# EAGLE design rz568m-power-data-v2 (EAGLE 7.7.0)
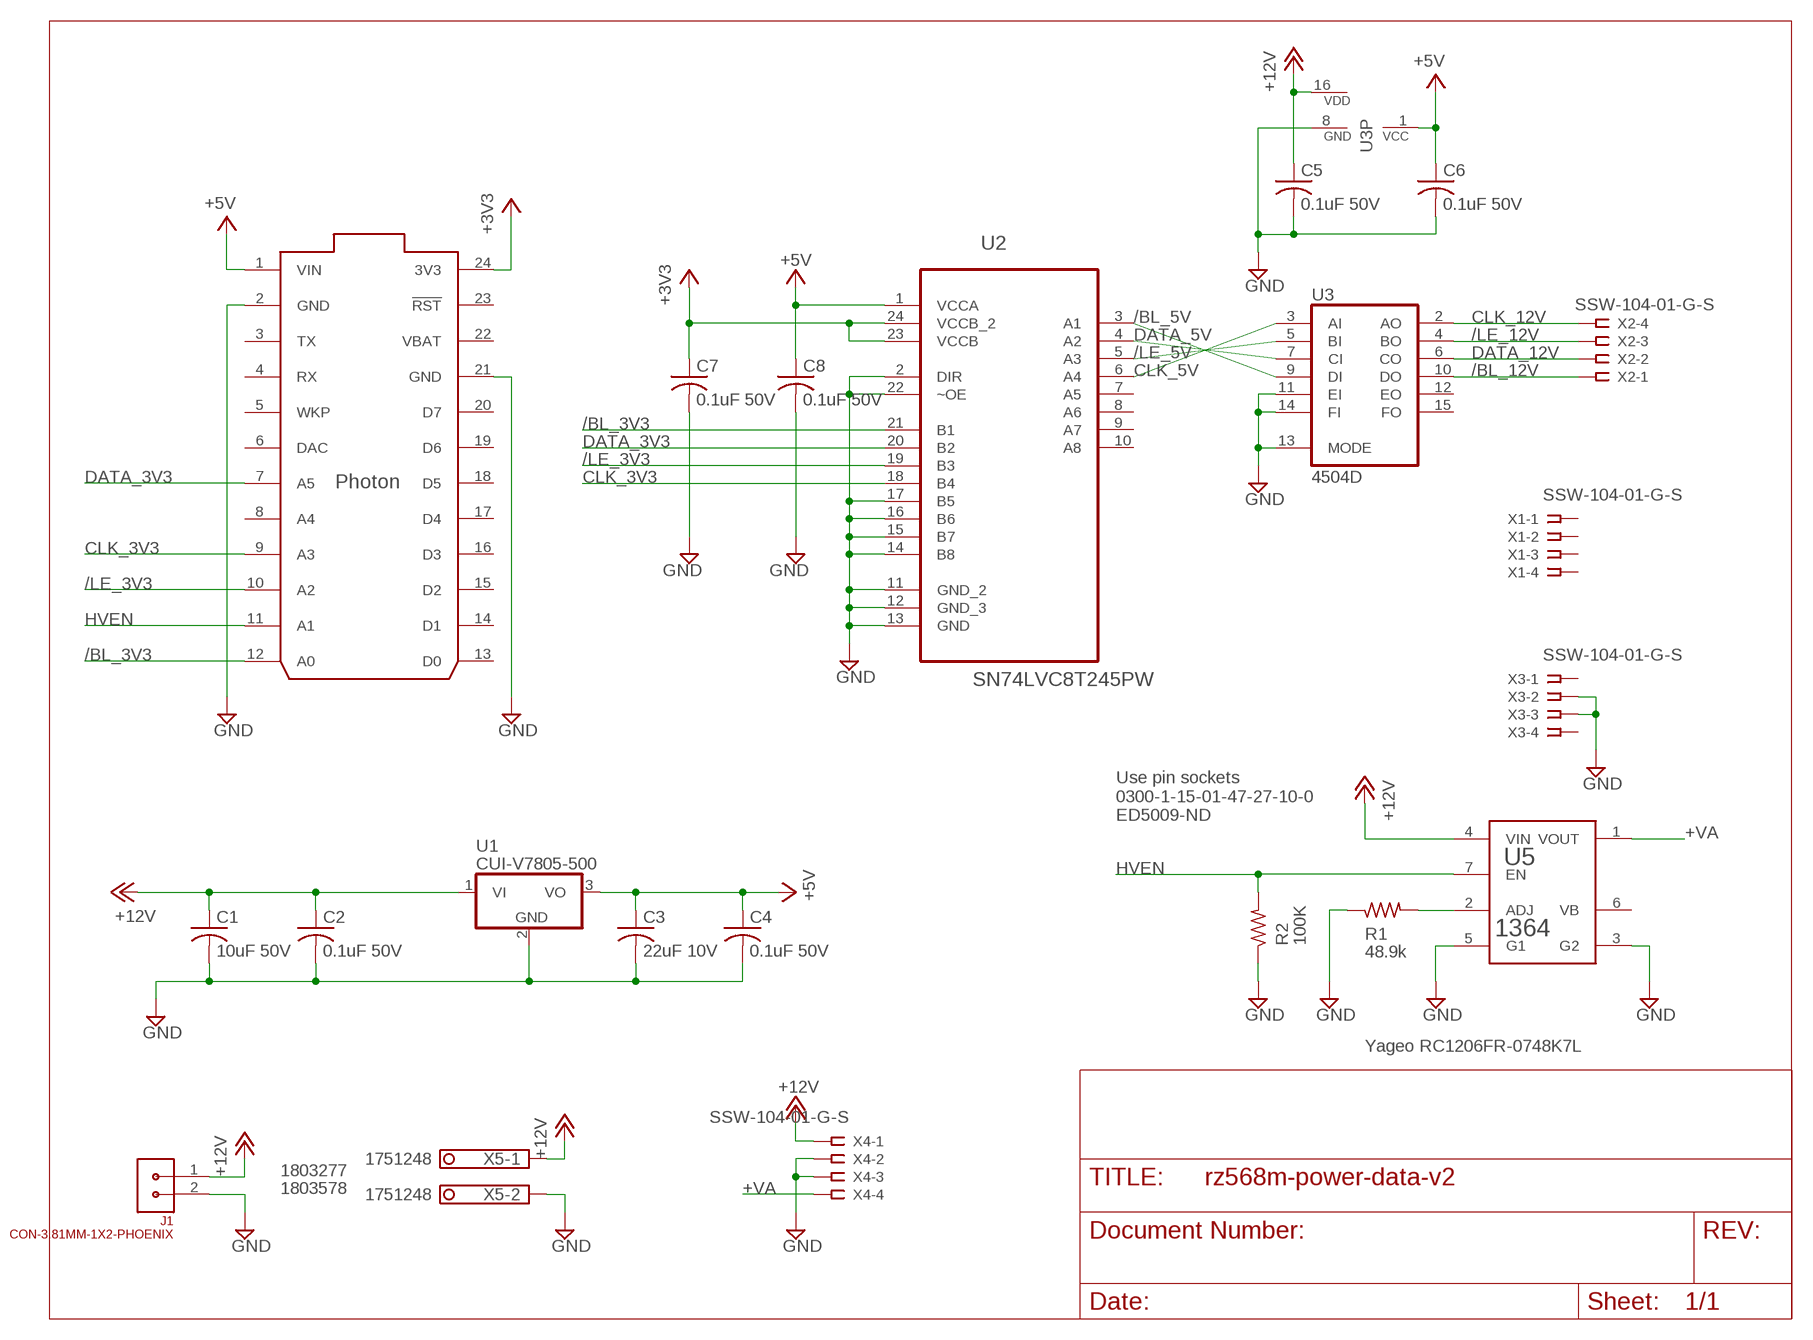
[diagram p0: schematic, sheet 1]

## Parts
C1  10uF 50V  C-USC1210K  [C1210K]
C2  0.1uF 50V  C-USC1206K  [C1206K]
C3  22uF 10V  C-USC1206K  [C1206K]
C4  0.1uF 50V  C-USC1206K  [C1206K]
C5  0.1uF 50V  C-USC0805K  [C0805K]
C6  0.1uF 50V  C-USC0805K  [C0805K]
C7  0.1uF 50V  C-USC0805K  [C0805K]
C8  0.1uF 50V  C-USC0805K  [C0805K]
J1  CON-3.81MM-1X2-PHOENIX  [CON-PHOENIX-3.81-1X2-RA]
R1  48.9k  R-US_R1206  [R1206]
R2  100K  R-US_R1206  [R1206]
U1  CUI-V7805-500  CUI-V7803-500  [CUI-78XX-500]
U2  SN74LVC8T245PW  SN74AVC8T245PW  [SOP65P640X120-24N]
U3  4504D  [SO16]
U4  PHOTON_WITH_HEADERS  [PHOTON]
U5  1364  [1364]
X1  SSW-104-01-G-S  SSW-104-02-S-S  [SSW-104-02-S-S]
X2  SSW-104-01-G-S  SSW-104-02-S-S  [SSW-104-02-S-S]
X3  SSW-104-01-G-S  SSW-104-02-S-S  [SSW-104-02-S-S]
X4  SSW-104-01-G-S  SSW-104-02-S-S  [SSW-104-02-S-S]
X5  1751248  [1751248]

## Nets
+3V3: C7.1 U2.23(VCCB) U2.24(VCCB_2) U4.24(3V3)
+5V: C3.1 C4.1 C6.1 C8.1 U1.3(VO) U2.1(VCCA) U3.1(VCC) U4.1(VIN)
+12V: C1.1 C2.1 C5.1 J1.1 U1.1(VI) U3.16(VDD) U5.4(VIN) X4.1 X5.1
+VA: U5.1(VOUT) X4.4
/BL_3V3: U2.21(B1) U4.12(A0)
/BL_5V: U2.3(A1) U3.9(DI)
/BL_12V: U3.10(DO) X2.1
/LE_3V3: U2.19(B3) U4.10(A2)
/LE_5V: U2.5(A3) U3.5(BI)
/LE_12V: U3.4(BO) X2.3
CLK_3V3: U2.18(B4) U4.9(A3)
CLK_5V: U2.6(A4) U3.3(AI)
CLK_12V: U3.2(AO) X2.4
DATA_3V3: U2.20(B2) U4.7(A5)
DATA_5V: U2.4(A2) U3.7(CI)
DATA_12V: U3.6(CO) X2.2
GND: C1.2 C2.2 C3.2 C4.2 C5.2 C6.2 C7.2 C8.2 J1.2 R1.1 R2.1 U1.2(GND) U2.2(DIR) U2.11(GND_2) U2.12(GND_3) U2.13(GND) U2.14(B8) U2.15(B7) U2.16(B6) U2.17(B5) U2.22(~OE) U3.8(GND) U3.11(EI) U3.13(MODE) U3.14(FI) U4.2(GND) U4.21(GND) U5.3(G2) U5.5(G1) X3.2 X3.3 X4.2 X4.3 X5.2
HVEN: R2.2 U4.11(A1) U5.7(EN)
N$3: R1.2 U5.2(ADJ)
Unconnected: U2.7(A5) U2.8(A6) U2.9(A7) U2.10(A8) U3.12(EO) U3.15(FO) U4.3(TX) U4.4(RX) U4.5(WKP) U4.6(DAC) U4.8(A4) U4.13(D0) U4.14(D1) U4.15(D2) U4.16(D3) U4.17(D4) U4.18(D5) U4.19(D6) U4.20(D7) U4.23(!RST) U5.6(VB) X1.1 X1.2 X1.3 X1.4 X3.1 X3.4

## Notes on the sheet
- Use pin sockets
  0300-1-15-01-47-27-10-0
  ED5009-ND
- Yageo RC1206FR-0748K7L
- 1803277
- 1803578

## Power pins joined to a net without a drawn wire
VBAT: U4.22(VBAT)

## Library data of the parts
C1 = rcl:C-US: CAPACITOR, American symbol; MFR: KEMET; MFR_PART_NO: C1210C106K5RACTU
C2 C4-C8 = rcl:C-US: CAPACITOR, American symbol; MFR: KEMET; MFR_PART_NO: C1206S104M5RACTU
C3 = rcl:C-US: CAPACITOR, American symbol; MFR: KEMET; MFR_PART_NO: C1206C226K8RAC7800
J1 = 0GlenConnectors:CON-3.81MM-1X2-PHOENIX
R1 R2 = rcl:R-US_: RESISTOR, American symbol
U1 = GlenPartsLibrary:CUI-V7803-500
U2 = Texas Instruments_By_element14_Batch_1:SN74AVC8T245PW: TRANSCEIVER; MPN: SN74AVC8T245PW; OC_FARNELL: 1053490; OC_NEWARK: 10J9626; PACKAGE: TSSOP-24; SUPPLIER: Texas Instruments
U3 = 45xx:4504: TTL or CMOS to CMOS hex LEVEL SHIFTER
U4 = Particle:PHOTON
U5 = TES:1364: TES1364 HVPS Horizontal module
X1-X4 = con-samtec:SSW-104-02-S-S: THROUGH-HOLE .025" SQ POST SOCKET Source: Samtec SSW.pdf; MPN: SSW-104-02-S-S; OC_FARNELL: unknown; OC_NEWARK: 11P9384
X5 = con-phoenix-350:1751248: MKDS 1/ 2-3,5 Printklemme Nennstrom: 10 A Bemessungsspannung: 160 V Raster: 3,5 mm Polzahl: 2 Montageart: Löten Anschlussart: Schraubanschluss Anschlussrichtung vom Leiter zur Platine: 0° Source: http://eshop.phoenixcontact.com .. 1751248.pdf; OC_FARNELL: unknown; OC_NEWARK: unknown

## Board
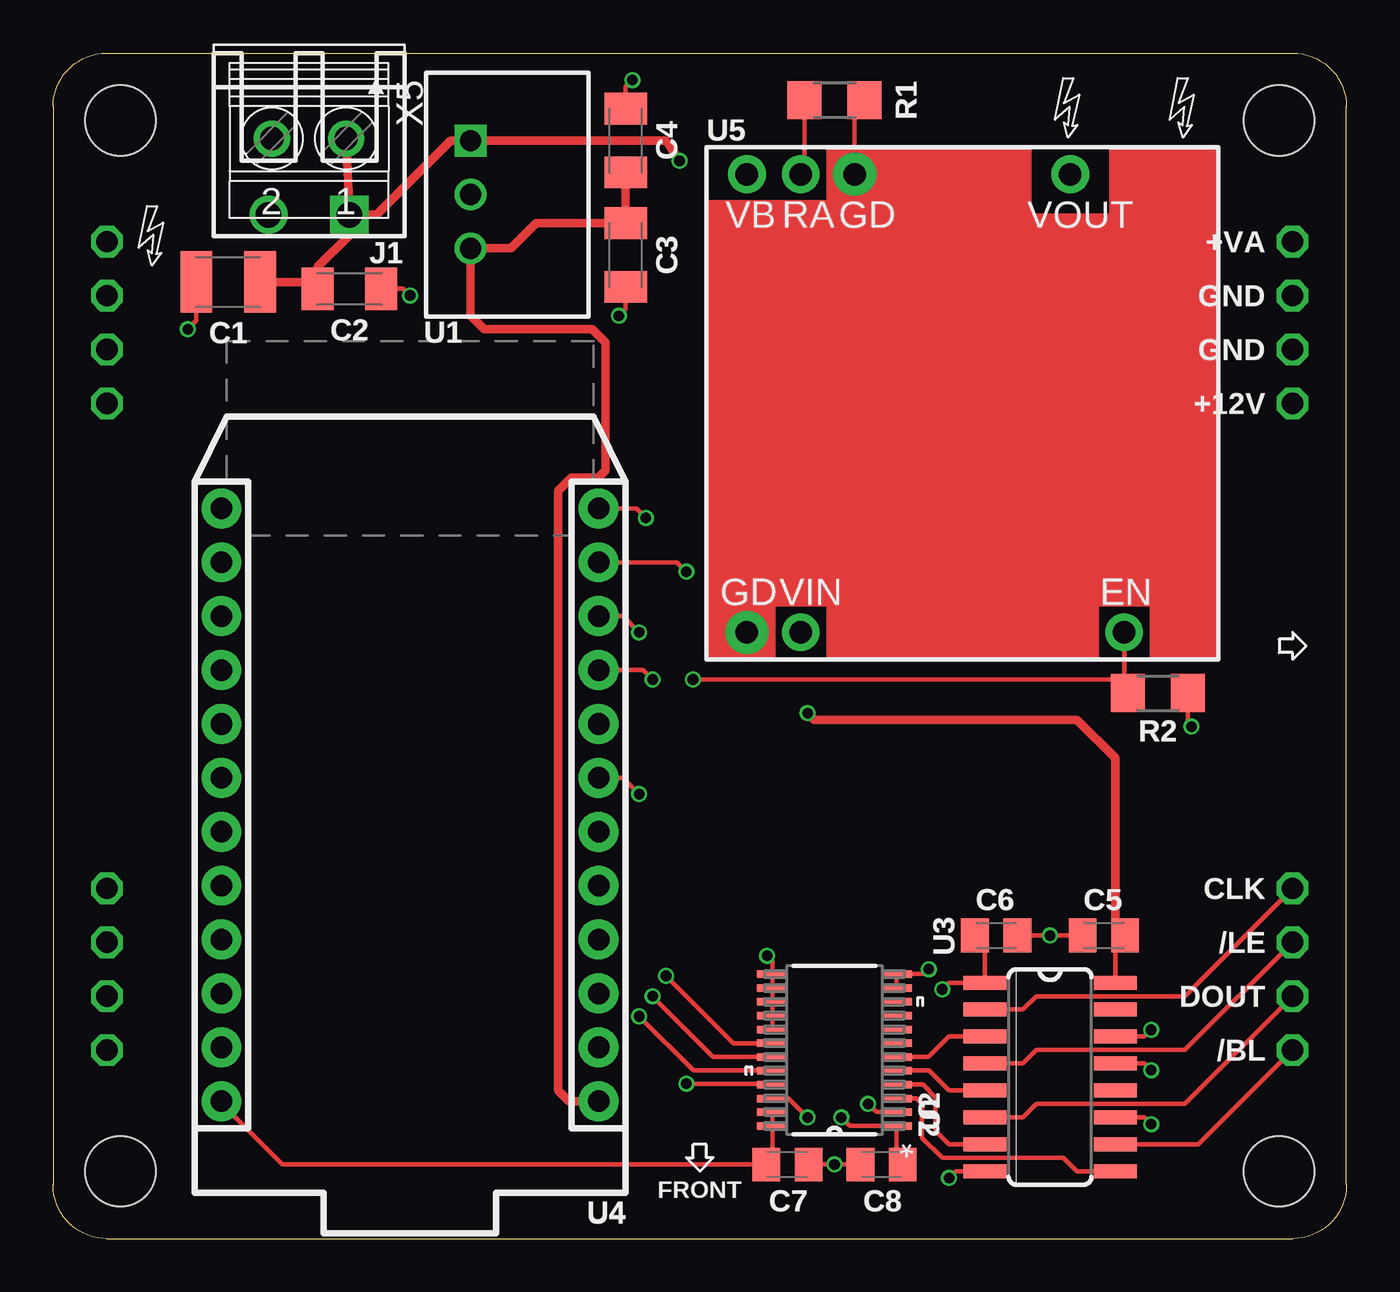
[diagram p1: board, top side]
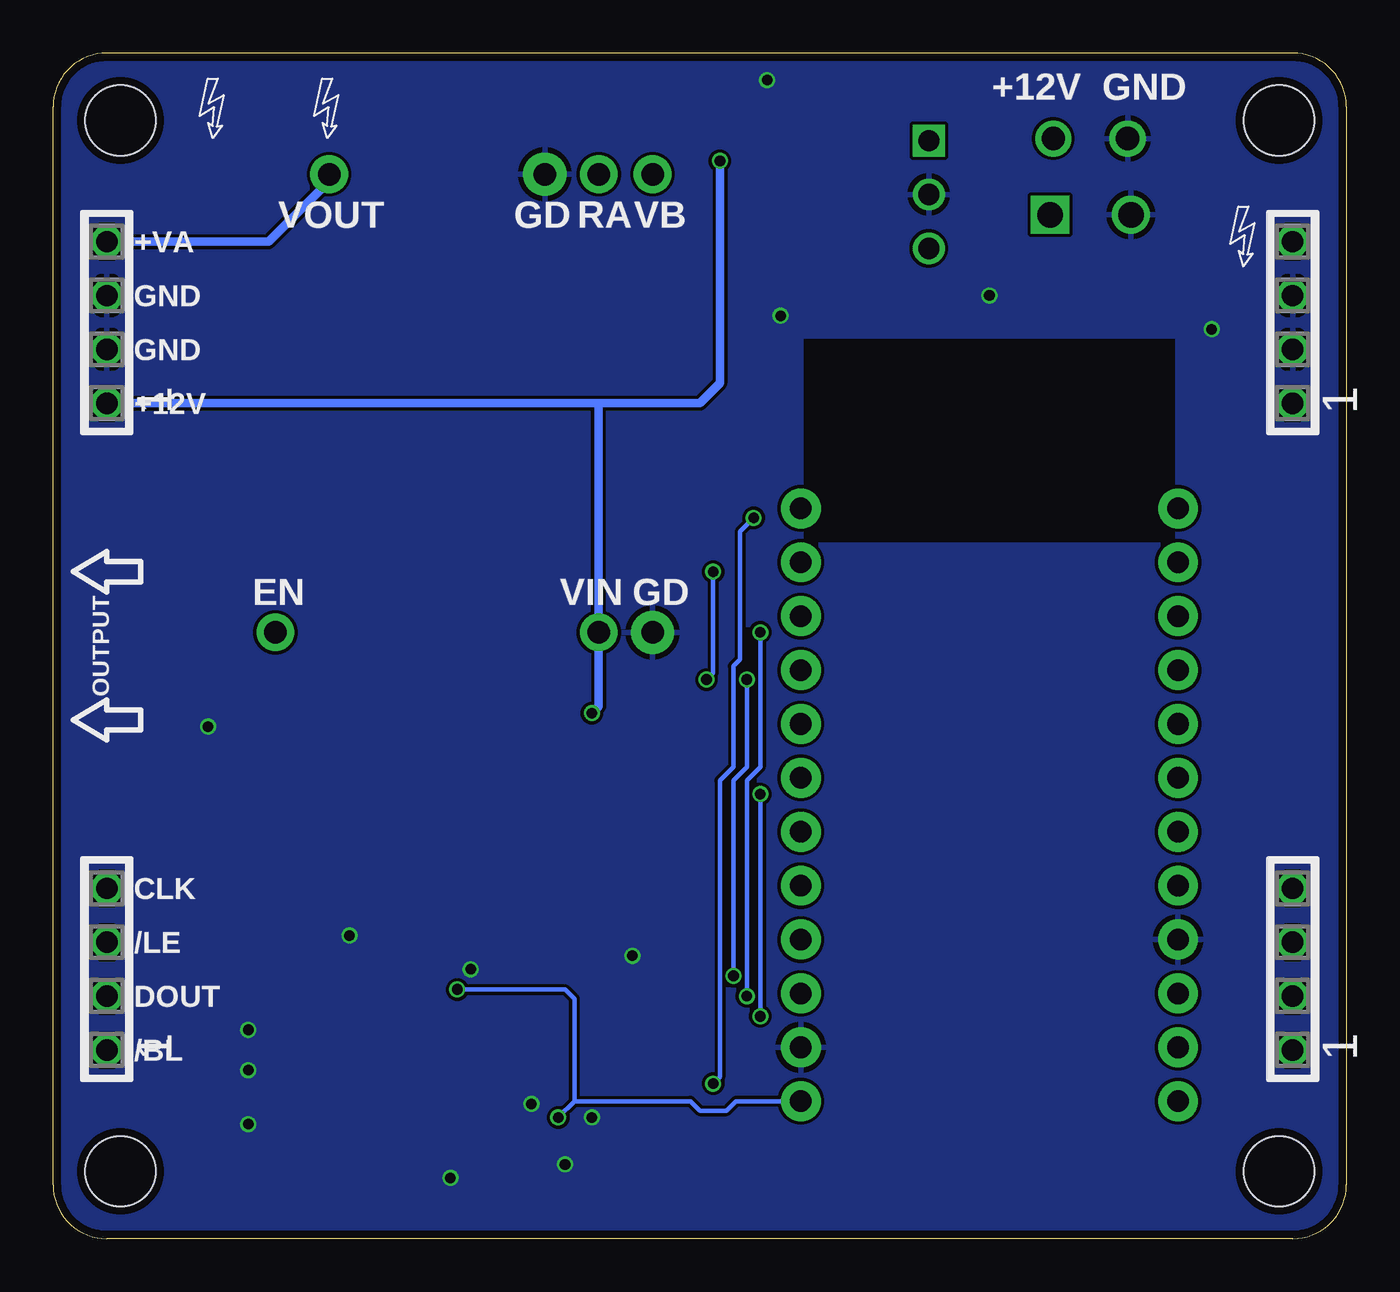
[diagram p2: board, bottom side, seen from below]

Size 60.96 x 55.88 mm. Coordinates in mm from the lower left corner, seen from the top.
Outline: 2.54,0 58.42,0 arc90 60.96,2.54 60.96,53.34 arc90 58.42,55.88 2.54,55.88 arc90 0,53.34 0,2.54 arc90 2.54,0
Copper layers (1*16): Top 0.035559375mm / dielectric 1.6mm / Bottom 0.035559375mm
Design rules "oshpark-2layer-2018": minimum track width 6mil, minimum drill 10mil, track to track 6mil, track to pad 6mil, pad to pad 6mil, via to via 6mil, smd to smd 6mil, copper to edge 15mil, drill to drill 6mil, minimum pad ring 5mil, minimum via ring 5mil, stop-mask expansion 2.5mil, vias tented up to drill 0mil, thermal gap 10mil
Holes 3.3 mm at 3.17,3.17 57.78,3.17 57.78,52.7 3.17,52.7

### Footprints (pad centres in the part's own frame; a part is rotated, then mirrored left to right if it is on the bottom)
C1210K = smd 1.5 x 2.9: 1 -1.5,0; 2 1.5,0
C1206K = smd 1.5 x 2: 1 -1.5,0; 2 1.5,0
C0805K = smd 1.3 x 1.6: 1 -1,0; 2 1,0
CON-PHOENIX-3.81-1X2-RA = drill 1.2 square: 1 0,0 | drill 1.2: 2 3.81,0
R1206 = smd 1.6 x 1.803: 1 -1.422,0; 2 1.422,0
CUI-78XX-500 = drill 1 square: 1 0,0 | drill 1: 2 2.54,0; 3 5.08,0
SOP65P640X120-24N = smd 1.473 x 0.356: 1 -2.921,3.581; 2 -2.921,2.921; 3 -2.921,2.286; 4 -2.921,1.626; 5 -2.921,0.965; 6 -2.921,0.33; 7 -2.921,-0.33; 8 -2.921,-0.965; 9 -2.921,-1.626; 10 -2.921,-2.286; 11 -2.921,-2.921; 12 -2.921,-3.581; 13 2.921,-3.581; 14 2.921,-2.921; 15 2.921,-2.286; 16 2.921,-1.626; 17 2.921,-0.965; 18 2.921,-0.33; 19 2.921,0.33; 20 2.921,0.965; 21 2.921,1.626; 22 2.921,2.286; 23 2.921,2.921; 24 2.921,3.581
SO16 = smd 0.66 x 2.032: 1 -4.445,-3.073; 2 -3.175,-3.073; 3 -1.905,-3.073; 4 -0.635,-3.073; 5 0.635,-3.073; 6 1.905,-3.073; 7 3.175,-3.073; 8 4.445,-3.073; 9 4.445,3.073; 10 3.175,3.073; 11 1.905,3.073; 12 0.635,3.073; 13 -0.635,3.073; 14 -1.905,3.073; 15 -3.175,3.073; 16 -4.445,3.073
PHOTON = drill 1.016 pad 1.88: 1 1.27,32.258; 2 1.27,29.718; 3 1.27,27.178; 4 1.27,24.638; 5 1.27,22.098; 6 1.27,19.558; 7 1.27,17.018; 8 1.27,14.478; 9 1.27,11.938; 10 1.27,9.398; 11 1.27,6.858; 12 1.27,4.318; 13 19.05,4.318; 14 19.05,6.858; 15 19.05,9.398; 16 19.05,11.938; 17 19.05,14.478; 18 19.05,17.018; 19 19.05,19.558; 20 19.05,22.098; 21 19.05,24.638; 22 19.05,27.178; 23 19.05,29.718; 24 19.05,32.258
1364 = drill 1.067 pad 1.778: 1 5.08,10.795; 2 -7.62,10.795; 4 -7.62,-10.795; 6 -10.16,10.795; 7 7.62,-10.795 | drill 1.067 pad 2.032: 3 -5.08,10.795; 5 -10.16,-10.795
SSW-104-02-S-S = drill 1 pad 1.5 octagon: 1 -3.81,0; 2 -1.27,0; 3 1.27,0; 4 3.81,0
1751248 = drill 1.1 pad 1.7: 1 -1.75,-0.1; 2 1.75,-0.1

### Placement (x,y rotation side)
C1  8.26,45.09 180 top
C2  13.97,44.77 0 top
C3  26.99,46.35 270 top
C4  26.99,51.75 90 top
C5  49.53,14.29 180 top
C6  44.45,14.29 0 top
C7  34.61,3.49 0 top
C8  39.05,3.49 180 top
J1  13.97,48.26 180 top
R1  36.83,53.66 180 top
R2  52.07,25.72 180 top
U1  19.68,51.75 270 top
U2  36.83,8.89 180 top
U3  46.99,7.62 270 top
U4  26.99,38.73 180 top
U5  42.86,39.37 0 top
X1  2.54,12.7 90 bottom
X2  58.42,12.7 90 bottom
X3  2.54,43.18 90 bottom
X4  58.42,43.18 90 bottom
X5  12.06,51.75 180 top

### Tracks (layer width: path | path; a pad name or v marks a point on that pad's centre or on a via)
+3V3
  Top 0.203: U2.23 U2.24 33.91,3.79 C7.1 10.79,3.49 7.94,6.35 U4.24
+5V  (via drill 0.5)
  Top 0.203: C8.1 39.75,3.79 U2.1 37.55,5.31 v37.15,5.71 37.47,5.4 | C6.1 43.92,13.82 U3.1 42.23,12.06 v41.91,11.75
  Top 0.406: C4.1 C3.1 22.77,47.85 21.59,46.67 U1.3 19.68,43.5 20.32,42.86 25.4,42.86 26.04,42.23 26.04,36.2 25.72,35.88 24.45,35.88 23.81,35.24 23.81,6.99 24.32,6.48 U4.1
  Bottom 0.203: U4.1 28.77,6.48 29.21,6.03 30.48,6.03 30.92,6.48 36.39,6.48 | 36.39,6.48 v37.15,5.71 | v41.91,11.75 36.83,11.75 36.39,11.3 36.39,6.48
+12V  (via drill 0.5)
  Top 0.203: U3.16 50.06,13.82 C5.1
  Top 0.406: C1.1 12.15,45.09 C2.1 12.47,45.81 13.97,47.31 J1.1 | J1.1 15.24,48.26 18.73,51.75 U1.1 28.89,51.75 v29.53,50.8 | 50.06,13.82 50.06,22.64 48.26,24.45 35.88,24.45 v35.56,24.77 | X5.1 J1.1
  Bottom 0.406: v29.53,50.8 29.53,40.32 30.48,39.37 35.24,39.37 | X4.1 35.24,39.37 | 35.24,39.37 U5.4 35.24,25.08 v35.56,24.77
+VA
  Bottom 0.406: U5.1 47.94,49.85 50.8,46.99 X4.4
/BL_3V3  (via drill 0.5)
  Top 0.203: U4.12 27.5,34.42 v27.94,33.97 | v29.84,7.3 33.87,7.3 U2.21
  Bottom 0.203: v27.94,33.97 28.57,33.34 28.57,27.3 28.89,26.99 28.89,22.23 29.53,21.59 29.53,7.62 v29.84,7.3
/BL_5V
  Top 0.203: U2.3 40.7,6.6 40.96,6.35 40.96,4.76 41.91,3.81 47.62,3.81 48.26,3.17 U3.9
/BL_12V
  Top 0.203: U3.10 53.98,4.45 X2.1
/LE_3V3  (via drill 0.5)
  Top 0.203: U4.10 26.86,29.34 v27.62,28.57 | v28.26,11.43 31.11,8.57 33.9,8.57 U2.19
  Bottom 0.203: v27.62,28.57 27.62,22.23 28.26,21.59 v28.26,11.43
/LE_5V
  Top 0.203: U2.5 41.29,7.92 42.23,6.99 U3.5
/LE_12V
  Top 0.203: U3.4 45.72,8.26 46.35,8.89 53.34,8.89 X2.3
CLK_3V3  (via drill 0.5)
  Top 0.203: U4.9 27.81,26.8 v28.26,26.35 | v28.89,12.38 32.07,9.21 33.9,9.21 U2.18
  Bottom 0.203: v28.26,26.35 28.26,22.23 28.89,21.59 v28.89,12.38
CLK_5V
  Top 0.203: U2.6 41.26,8.56 42.23,9.53 U3.3
CLK_12V
  Top 0.203: U3.2 45.72,10.79 46.35,11.43 53.34,11.43 X2.4
DATA_3V3  (via drill 0.5)
  Top 0.203: U4.7 26.86,21.72 v27.62,20.95 | v27.62,10.48 30.18,7.92 U2.20
  Bottom 0.203: v27.62,20.95 v27.62,10.48
DATA_5V
  Top 0.203: U2.4 41,7.26 41.59,6.67 41.59,5.08 42.23,4.45 U3.7
DATA_12V
  Top 0.203: U3.6 45.72,5.71 46.35,6.35 53.34,6.35 X2.2
GND  (via drill 0.5)
  Top 0.203: C7.2 v36.83,3.49 C8.2 | C6.2 v46.99,14.29 C5.2 | U5.3 37.78,53.19 R1.1 | R2.1 53.49,24.3 v53.66,24.13 | U2.2 38.8,5.97 v38.42,6.35 | U3.8 42.55,3.17 v42.23,2.86 | U3.14 51.44,9.53 v51.75,9.84 | U3.13 51.44,8.26 v51.75,7.94 | U3.11 51.44,5.71 v51.75,5.4 | U2.11 U2.12 41.05,12.47 v41.27,12.7 | C1.2 6.75,43.27 v6.35,42.86 | C2.2 16.51,44.77 v16.83,44.45 | C4.2 26.99,54.29 v27.3,54.61 | C3.2 26.99,43.81 v26.67,43.5 | U2.22 34.67,6.6 v35.56,5.71 | U2.17 U2.16 U2.15 U2.14 U2.13 33.91,13.08 v33.66,13.34
  pour Bottom (isolate 0.152): 0,55.88 7.94,55.88 7.94,32.7 25.4,32.7 25.4,33.02 25.72,33.02 25.72,55.88 60.96,55.88 60.96,0 0,0
  pour Bottom (isolate 0.152): 7.94,55.88 7.94,42.55 25.72,42.55 25.72,55.88
HVEN  (via drill 0.5)
  Top 0.203: U4.11 29.4,31.88 v29.84,31.43 | v30.16,26.35 50.48,26.35 | 50.48,26.35 50.65,26.35 R2.2 | U5.7 50.48,26.35
  Bottom 0.203: v29.84,31.43 29.84,26.67 v30.16,26.35
N$3
  Top 0.203: R1.2 35.41,50.33 U5.2

### Text on the board
_tsilk: R1 | C4 | U5 | J1 | +VA | C3 | GND | C1 | C2 | U1 | GND | +12V | R2 | CLK | C6 | C5 | /LE | U3 | DOUT | /BL | U2 | U4 | FRONT | C7 | C8
_bsilk: GND | +12V | VB | RA | GD | VOUT | +VA | GND | GND | +12V | GD | VIN | EN | OUTPUT | CLK | /LE | DOUT | /BL